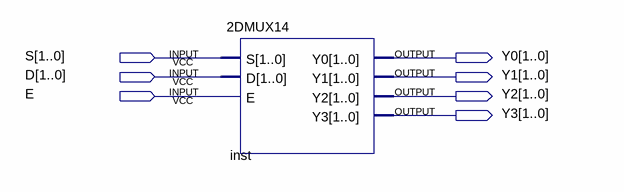
[diagram p0: schematic sheet]
// Quartus schematic main_work.bdf as structural Verilog: 1 symbols, 7 pins
module main_work (
  input  [1:0] S,
  input  [1:0] D,
  input  E,
  output [1:0] Y0,
  output [1:0] Y1,
  output [1:0] Y2,
  output [1:0] Y3
);

  \2DMUX14  inst (.S(S), .D(D), .E(E), .Y0(Y0), .Y1(Y1), .Y2(Y2), .Y3(Y3));
endmodule
